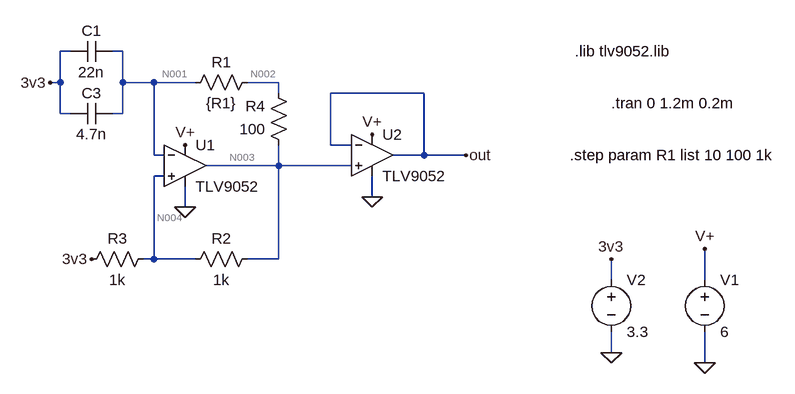
[diagram p0: schematic Oscillator.asc]
Oscillator.asc, the LTspice schematic file:
Version 4.1
SHEET 1 1432 680
WIRE -176 112 -192 112
WIRE -96 112 -112 112
WIRE -192 160 -192 112
WIRE -192 160 -208 160
WIRE -96 160 -96 112
WIRE -48 160 -96 160
WIRE 16 160 -48 160
WIRE 144 160 96 160
WIRE 144 176 144 160
WIRE 368 176 224 176
WIRE -192 208 -192 160
WIRE -176 208 -192 208
WIRE -96 208 -96 160
WIRE -96 208 -112 208
WIRE 224 256 224 176
WIRE 256 256 224 256
WIRE -48 272 -48 160
WIRE -32 272 -48 272
WIRE 368 272 368 176
WIRE 368 272 320 272
WIRE 432 272 368 272
WIRE 144 288 144 256
WIRE 144 288 32 288
WIRE 256 288 144 288
WIRE -32 304 -48 304
WIRE 288 336 288 304
WIRE 0 352 0 320
WIRE -48 432 -48 304
WIRE -48 432 -64 432
WIRE 16 432 -48 432
WIRE 144 432 144 288
WIRE 144 432 96 432
WIRE 656 464 656 432
WIRE 800 464 800 416
WIRE 656 576 656 544
WIRE 800 592 800 544
FLAG 0 256 V+
FLAG 800 416 V+
FLAG 800 592 0
FLAG 656 432 3v3
FLAG 656 576 0
FLAG 0 352 0
FLAG -144 432 3v3
FLAG -208 160 3v3
FLAG 288 240 V+
FLAG 288 336 0
FLAG 432 272 out
SYMBOL OpAmps\\opamp2 0 224 R0
SYMATTR InstName U1
SYMATTR Value TLV9052
SYMBOL res 112 144 R90
WINDOW 0 0 56 VBottom 2
WINDOW 3 32 56 VTop 2
SYMATTR InstName R1
SYMATTR Value {R1}
SYMBOL res 112 416 R90
WINDOW 0 0 56 VBottom 2
WINDOW 3 32 56 VTop 2
SYMATTR InstName R2
SYMATTR Value 1k
SYMBOL res -48 416 R90
WINDOW 0 0 56 VBottom 2
WINDOW 3 32 56 VTop 2
SYMATTR InstName R3
SYMATTR Value 1k
SYMBOL cap -112 96 R90
WINDOW 0 0 32 VBottom 2
WINDOW 3 32 32 VTop 2
SYMATTR InstName C1
SYMATTR Value 22n
SYMBOL res 160 272 R180
WINDOW 0 36 76 Left 2
WINDOW 3 36 40 Left 2
SYMATTR InstName R4
SYMATTR Value 100
SYMBOL voltage 800 448 R0
SYMATTR InstName V1
SYMATTR Value 6
SYMBOL voltage 656 448 R0
SYMATTR InstName V2
SYMATTR Value 3.3
SYMBOL cap -112 192 R90
WINDOW 0 0 32 VBottom 2
WINDOW 3 32 32 VTop 2
SYMATTR InstName C3
SYMATTR Value 4.7n
SYMBOL OpAmps\\opamp2 288 208 R0
SYMATTR InstName U2
SYMATTR Value TLV9052
TEXT 600 112 Left 2 !.lib tlv9052.lib
TEXT 656 192 Left 2 !.tran 0 1.2m 0.2m
TEXT 592 272 Left 2 !.step param R1 list 10 100 1k

The netlist it stands for:
* Oscillator.asc
X§U1 N004 N001 V+ 0 N003 TLV9052  ; pins In+ In- V+ V- OUT
R1 N002 N001 {R1}
R2 N003 N004 1k
R3 N004 3v3 1k
C1 N001 3v3 22n
R4 N003 N002 100
V1 V+ 0 6
V2 3v3 0 3.3
C3 N001 3v3 4.7n
X§U2 N003 out V+ 0 out TLV9052  ; pins In+ In- V+ V- OUT
.lib tlv9052.lib
.tran 0 1.2m 0.2m
.step param R1 list 10 100 1k
.backanno
.end

* Results of the author's LTspice run, read from the files saved beside the schematic
* Operating Point (first step), zero values left out:
*   V(n001) = 3.301 V
*   V(n003) = 3.301 V
*   V(n002) = 3.301 V
*   V(out) = 3.301 V
*   V(n004) = 3.3 V
*   V(v+) = 6 V
*   V(3v3) = 3.3 V
*   I(R3) = 348 nA
*   I(V1) = -660.3 µA
*   I(R1) = 2.507 pA
*   I(R2) = 348 nA
*   I(R4) = 2.507 pA
*   I(V2) = 348 nA
*   Ix(u1:in+) = 3.775 pA
*   Ix(u1:in-) = 2.487 pA
*   Ix(u1:vcc) = 330.3 µA
*   Ix(u1:vee) = -330 µA
*   Ix(u1:out) = -348 nA
*   Ix(u2:in+) = 3.775 pA
*   Ix(u2:in-) = 2.531 pA
*   Ix(u2:vcc) = 330 µA
*   Ix(u2:vee) = -330 µA
*   Ix(u2:out) = -2.544 pA
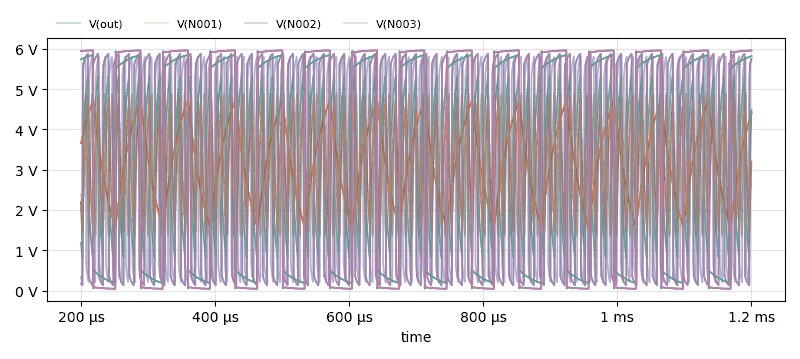
[diagram p1: Transient Analysis of Oscillator.asc, plotted from the saved traces]
* Transient Analysis, 3 runs:
*   V(out) [r1=10]: min 204.7 mV, max 5.812 V, average 3.174 V, rms 4.033 V, last 5.754 V
*   V(out) [r1=100]: min 130.9 mV, max 5.878 V, average 3.176 V, rms 4.171 V, last 5.746 V
*   V(out) [r1=1000]: min 44.18 mV, max 5.963 V, average 3.216 V, rms 4.347 V, last 5.96 V
*   V(N001) [r1=10]: min 1.4 V, max 4.856 V, average 3.167 V, rms 3.356 V, last 4.422 V
*   V(N001) [r1=100]: min 1.468 V, max 4.804 V, average 3.17 V, rms 3.338 V, last 3.205 V
*   V(N001) [r1=1000]: min 1.575 V, max 4.719 V, average 3.193 V, rms 3.331 V, last 4.418 V
*   V(N002) [r1=10]: min 1.34 V, max 4.906 V, average 3.168 V, rms 3.363 V, last 4.543 V
*   V(N002) [r1=100]: min 815.9 mV, max 5.328 V, average 3.173 V, rms 3.565 V, last 4.476 V
*   V(N002) [r1=1000]: min 185 mV, max 5.847 V, average 3.213 V, rms 4.19 V, last 5.819 V
*   V(N003) [r1=10]: min 203.1 mV, max 5.812 V, average 3.173 V, rms 4.033 V, last 5.756 V
*   V(N003) [r1=100]: min 130.3 mV, max 5.878 V, average 3.176 V, rms 4.17 V, last 5.746 V
*   V(N003) [r1=1000]: min 43.87 mV, max 5.962 V, average 3.215 V, rms 4.347 V, last 5.959 V